# EAGLE design new inverter (EAGLE 9.3.2)
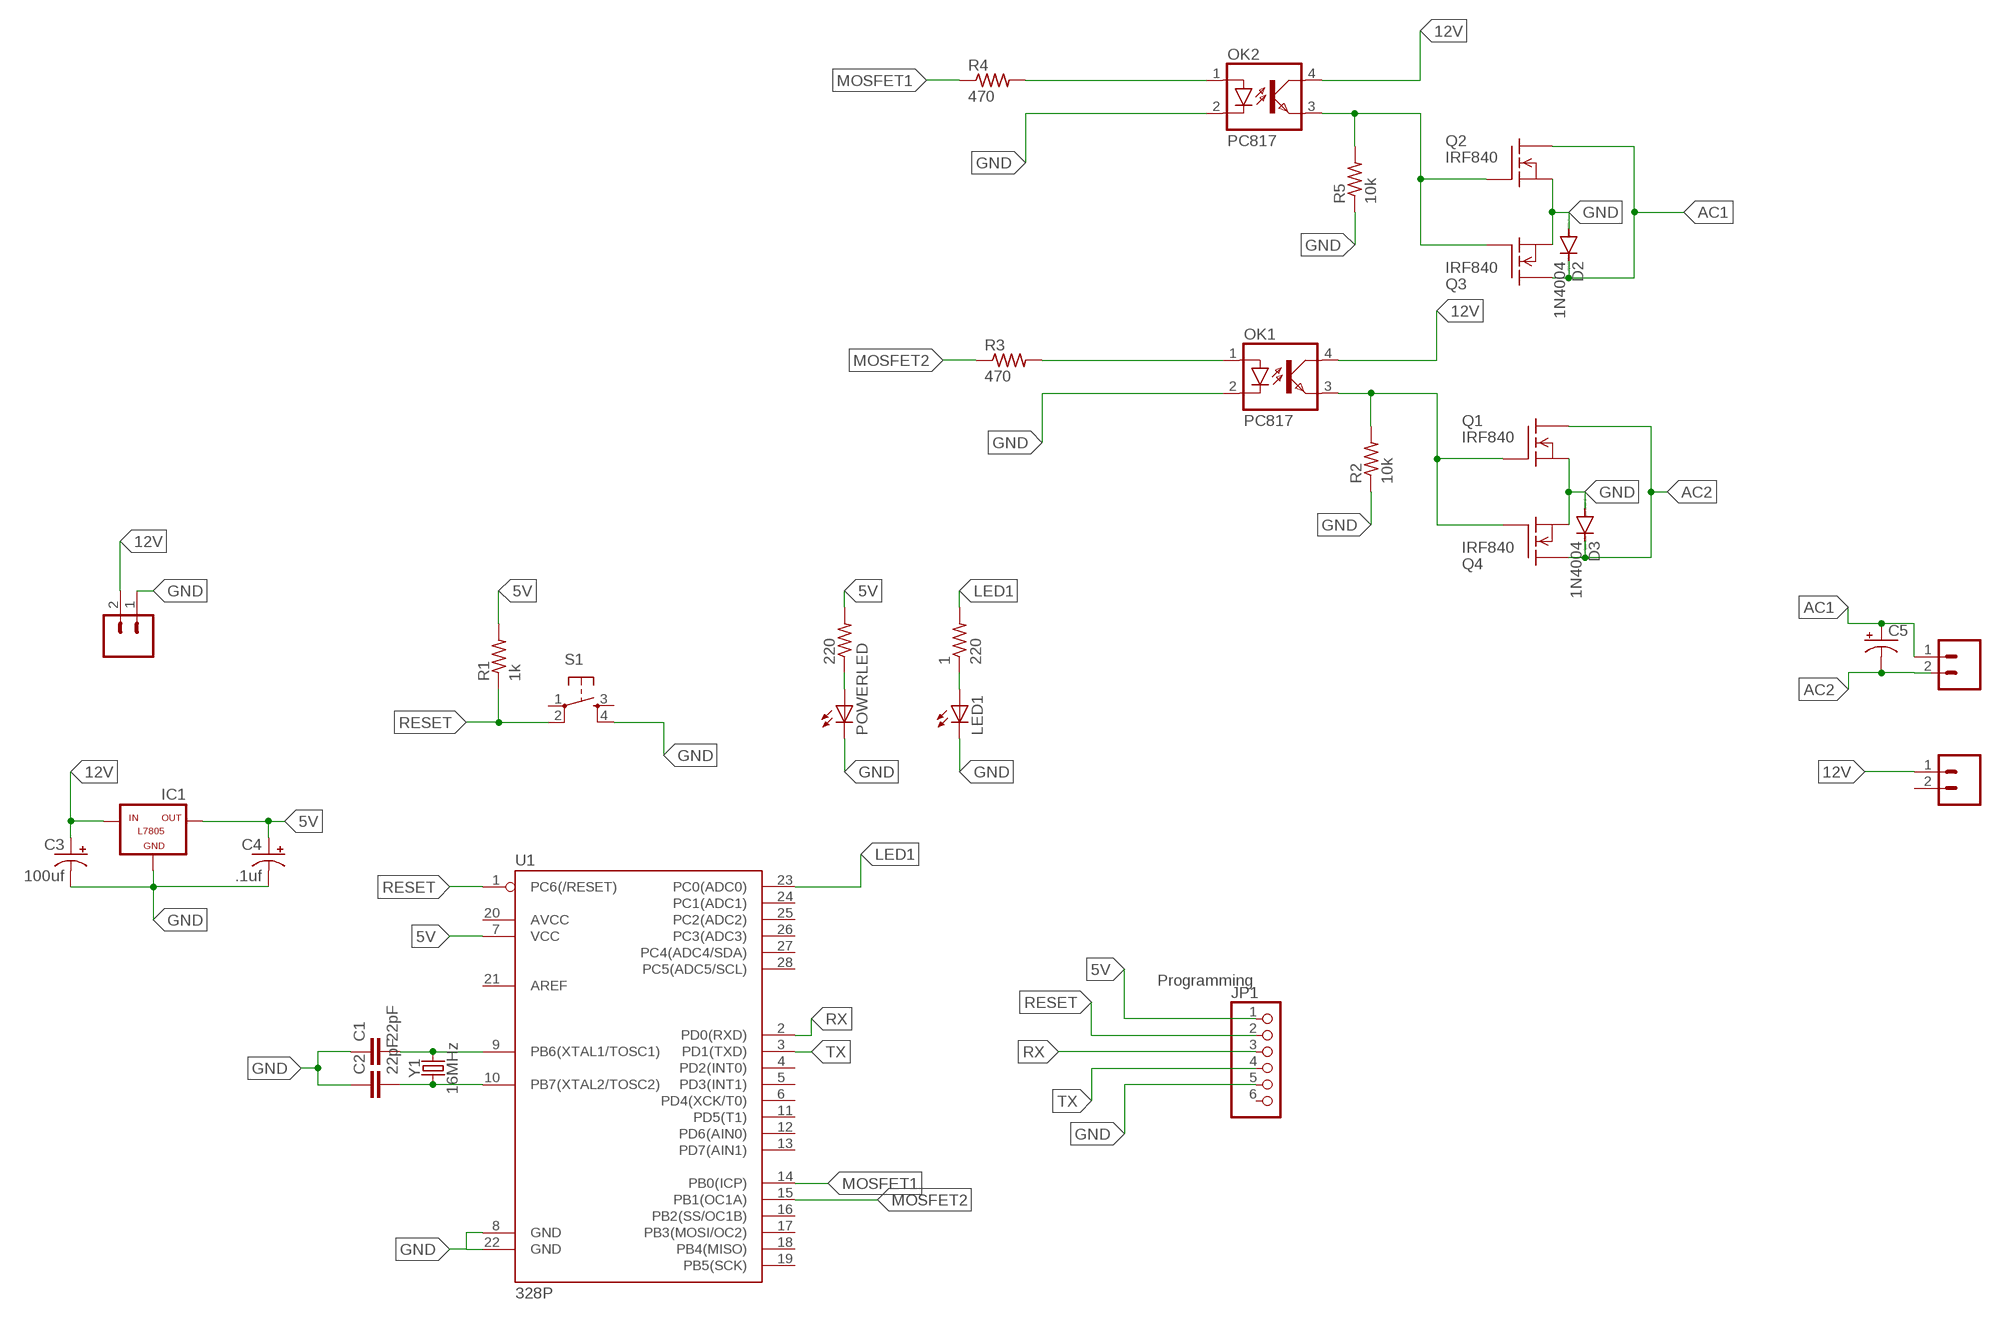
[diagram p0: schematic, sheet 1]

## Parts
1  220  R-US_0204/5  [0204/5]
220  R-US_0204/5  [0204/5]
C1  22pF  22PF-PTH-2.54MM-200V-5%  [CAP-PTH-2.54]
C2  22pF  22PF-PTH-2.54MM-200V-5%  [CAP-PTH-2.54]
C3  100uf  CPOL-USE5-5  [E5-5]
C4  .1uf  CPOL-USE5-5  [E5-5]
C5  CPOL-USE5-13  [E5-13]
D2  1N4004  [DO41-10]
D3  1N4004  [DO41-10]
IC1  L7805  [78XXL]
J1  CONN_025MM  [SCREWTERMINAL-5MM-2]
J2  CONN_025MM  [SCREWTERMINAL-5MM-2]
J3  CONN_025MM  [SCREWTERMINAL-5MM-2]
JP1  PINHD-1X6  [1X06]
LED1  LED5MM  [LED5MM]
OK1  PC817  [DIL04]
OK2  PC817  [DIL04]
POWERLED  LED5MM  [LED5MM]
Q1  IRF840  [TO220]
Q2  IRF840  [TO220]
Q3  IRF840  [TO220]
Q4  IRF840  [TO220]
R1  1k  R-US_0204/5  [0204/5]
R2  10k  R-US_0204/5  [0204/5]
R3  470  R-US_0204/5  [0204/5]
R4  470  R-US_0204/5  [0204/5]
R5  10k  R-US_0204/5  [0204/5]
S1  TAC_SWITCHPTH  [TACTILE-PTH]
U1  328P  ATMEGA328P_PDIP  [DIP28]
Y1  16MHz  CRYSTAL-16MHZPTH-HC49US  [HC49US]

## Nets
5V: 220.2 C4.+ IC1.OUT JP1.1 R1.2 U1.7(VCC)
12V: C3.+ IC1.IN J1.2 J2.1 OK1.4(COL) OK2.4(COL)
AC1: C5.+ D2.C J3.1 Q2.2(D) Q3.2(D)
AC2: C5.- D3.C J3.2 Q1.2(D) Q4.2(D)
GND: C1.1 C2.1 C3.- C4.- D2.A D3.A IC1.GND J1.1 JP1.5 LED1.K(C) OK1.2(C) OK2.2(C) POWERLED.K(C) Q1.3(S) Q2.3(S) Q3.3(S) Q4.3(S) R2.1 R5.1 S1.4 U1.8(GND) U1.22(GND)
LED1: 1.2 U1.23(PC0(ADC0))
MOSFET1: R4.1 U1.14(PB0(ICP))
MOSFET2: R3.1 U1.15(PB1(OC1A))
N$1: 220.1 POWERLED.A
N$2: C1.2 U1.9(PB6(XTAL1/TOSC1)) Y1.2
N$3: C2.2 U1.10(PB7(XTAL2/TOSC2)) Y1.1
N$4: OK1.1(A) R3.2
N$5: OK1.3(EMIT) Q1.1(G) Q4.1(G) R2.2
N$6: OK2.3(EMIT) Q2.1(G) Q3.1(G) R5.2
N$7: OK2.1(A) R4.2
N$8: 1.1 LED1.A
RESET: JP1.2 R1.1 S1.2 U1.1(PC6(/RESET))
RX: JP1.3 U1.2(PD0(RXD))
TX: JP1.4 U1.3(PD1(TXD))
Unconnected: J2.2 JP1.6 S1.1 S1.3 U1.4(PD2(INT0)) U1.5(PD3(INT1)) U1.6(PD4(XCK/T0)) U1.11(PD5(T1)) U1.12(PD6(AIN0)) U1.13(PD7(AIN1)) U1.16(PB2(SS/OC1B)) U1.17(PB3(MOSI/OC2)) U1.18(PB4(MISO)) U1.19(PB5(SCK)) U1.20(AVCC) U1.21(AREF) U1.24(PC1(ADC1)) U1.25(PC2(ADC2)) U1.26(PC3(ADC3)) U1.27(PC4(ADC4/SDA)) U1.28(PC5(ADC5/SCL))

## Notes on the sheet
- Programming

## Library data of the parts
1 220 R1-R5 = adafruit:R-US_: RESISTOR, American symbol
C1 C2 = SparkFun-Capacitors:22PF: 22pF ceramic capacitors A capacitor is a passive two-terminal electrical component used to store electrical energy temporarily in an electric field.; PROD_ID: CAP-09128
C3-C5 = adafruit:CPOL-US: POLARIZED CAPACITOR, American symbol
D2 D3 = diode:1N4004: DIODE general purpose rectifier, 1 A
IC1 = tango:L7805: VOLTAGE REGULATOR
J1-J3 = SparkFun-Connectors:CONN_02: Multi connection point. Often used as Generic Header-pin footprint for 0.1 inch spaced/style header connections On any of the 0.1 inch spaced packages, you can populate with these: Break Away Headers - Straight <https://www.sparkfun.com/products/116> (PRT-00116) Break Away Male Headers - Right Angle <https://www.sparkfun.com/products/553> (PRT-00553) Female Headers <https://www.sparkfun.com/products/115> (PRT-00115) Break Away Headers - Machine Pin <https://www.sparkfun.com/products/117> (PRT-00117) Break Away Female Headers - Swiss Machine Pin <https://www.sparkfun.com/products/743> (PRT-00743) For SCREWTERMINALS and SPRING TERMINALS visit here: Screw Terimnals on SparkFun.com <https://www.sparkfun.com/search/results?term=Screw+Terminals> (5mm/3.5mm/2.54mm spacing) This device is also useful as a general connection point to wire up your design to another part of your project. Our various solder wires solder well into these plated through hole pads. Hook-Up Wire - Assortment (Stranded, 22 AWG) <https://www.sparkfun.com/products/11375> (PRT-11375) Hook-Up Wire - Assortment (Solid Core, 22 AWG) <https://www.sparkfun.com/products/11367> (PRT-11367) View the entire wire category on our website here <https://www.sparkfun.com/categories/141> Special notes: Molex polarized connector foot print use with: PRT-08233 with associated crimp pins and housings. 2.54_SCREWTERM for use with PRT-10571. 3.5mm Screw Terminal footprints for PRT-08084 5mm Screw Terminal footprints for use with PRT-08432; SF_SKU: PRT-08432
JP1 = adafruit:PINHD-1X6: PIN HEADER
LED1 POWERLED = adafruit:LED: LED OSRAM: - CHIPLED LG R971, LG N971, LY N971, LG Q971, LY Q971, LO R971, LY R971 LH N974, LH R974 LS Q976, LO Q976, LY Q976 LO Q996 - Hyper CHIPLED LW Q18S LB Q993, LB Q99A, LB R99A - SideLED LS A670, LO A670, LY A670, LG A670, LP A670 LB A673, LV A673, LT A673, LW A673 LH A674 LY A675 LS A676, LA A676, LO A676, LY A676, LW A676 LS A679, LY A679, LG A679 - Hyper Micro SIDELED® LS Y876, LA Y876, LO Y876, LY Y876 LT Y87S - SmartLED LW L88C, LW L88S LB L89C, LB L89S, LG L890 LS L89K, LO L89K, LY L89K LS L896, LA L896, LO L896, LY L896 - TOPLED LS T670, LO T670, LY T670, LG T670, LP T670 LSG T670, LSP T670, LSY T670, LOP T670, LYG T670 LG T671, LOG T671, LSG T671 LB T673, LV T673, LT T673, LW T673 LH T674 LS T676, LA T676, LO T676, LY T676, LB T676, LH T676, LSB T676, LW T676 LB T67C, LV T67C, LT T67C, LS T67K, LO T67K, LY T67K, LW E67C LS E67B, LA E67B, LO E67B, LY E67B, LB E67C, LV E67C, LT E67C LW T67C LS T679, LY T679, LG T679 LS T770, LO T770, LY T770, LG T770, LP T770 LB T773, LV T773, LT T773, LW T773 LH T774 LS E675, LA E675, LY E675, LS T675 LS T776, LA T776, LO T776, LY T776, LB T776 LHGB T686 LT T68C, LB T68C - Hyper Mini TOPLED® LB M676 - Mini TOPLED Santana® LG M470 LS M47K, LO M47K, LY M47K Source: http://www.osram.convergy.de/
OK1 OK2 = optocoupler:PC817: SHARP OPTO COUPLER; MPN: PC817X4J000F; OC_FARNELL: 9707727; OC_NEWARK: 97K7059
Q1-Q4 = transistor-fet:IRF840: N-Channel Enhancement MOSFET (HEXFET); 500V; 8A; 0,85Ohm
S1 = SparkFun-Retired:TAC_SWITCH: Momentary Switch Button commonly used for reset or general input. Spark Fun Electronics SKU : COM-00097 SMT- SWCH-08247
U1 = SparkFun-IC-Microcontroller:ATMEGA328P_PDIP: Atmel 328P Through hole ATMEGA328P uC used in the Arduino 32kb flash, 1k EEPROM, 2k SRAM Datasheet <http://www.sparkfun.com/datasheets/Components/SMD/ATMega328.pdf> SparkFun Products Storefront component: AVR 28 Pin 20MHz 32K 6A/D - ATMega328P <https://www.sparkfun.com/products/9061> (COM-09061) SparkFun Simon Says - Through-Hole Soldering Kit <https://www.sparkfun.com/products/10547> (KIT-10547) SparkFun Learn to Solder - Simon Says <https://www.sparkfun.com/products/13708> (KIT-13708) SparkFun BigTime Watch Kit <https://www.sparkfun.com/products/11734> (KIT-11734) SparkFun ClockIt <https://www.sparkfun.com/products/10930> (KIT-10930) SparkFun Serial Enabled LCD Kit <https://www.sparkfun.com/products/10097> (LCD-10097) SparkFun Simon Tilts - Through Hole Soldering Kit <https://www.sparkfun.com/products/12634> (KIT-12634) SparkFun Frequency Counter Kit <https://www.sparkfun.com/products/10140> (KIT-10140) FabFM Radio Kit <https://www.sparkfun.com/products/11043> (KIT-11043) SparkFun Binary Blaster Kit <https://www.sparkfun.com/products/12037> (KIT-12037) SparkFun Metro-Gnome <https://www.sparkfun.com/products/9236> (KIT-09236) ATmega328 with Arduino Optiboot (Uno) <https://www.sparkfun.com/products/10524> (DEV-10524); PROD_ID: IC-09136
Y1 = SparkFun-Clocks:CRYSTAL-16MHZ: 16MHz Crystal Digikey Example <http://www.digikey.com/product-search/en?keywords=535-9122-1-ND> Frequency: 16MHz Frequency Stability: ±50ppm Frequency Tolerance: ±20ppm Load Capacitance: 18pF SparkFun Products: Pro Micro -5V/16MHz <https://www.sparkfun.com/products/12640> SparkFun Serial Enabled LCD Kit <https://www.sparkfun.com/products/10097>; PROD_ID: XTAL-08181; SF_ID: COM-00536

## Board
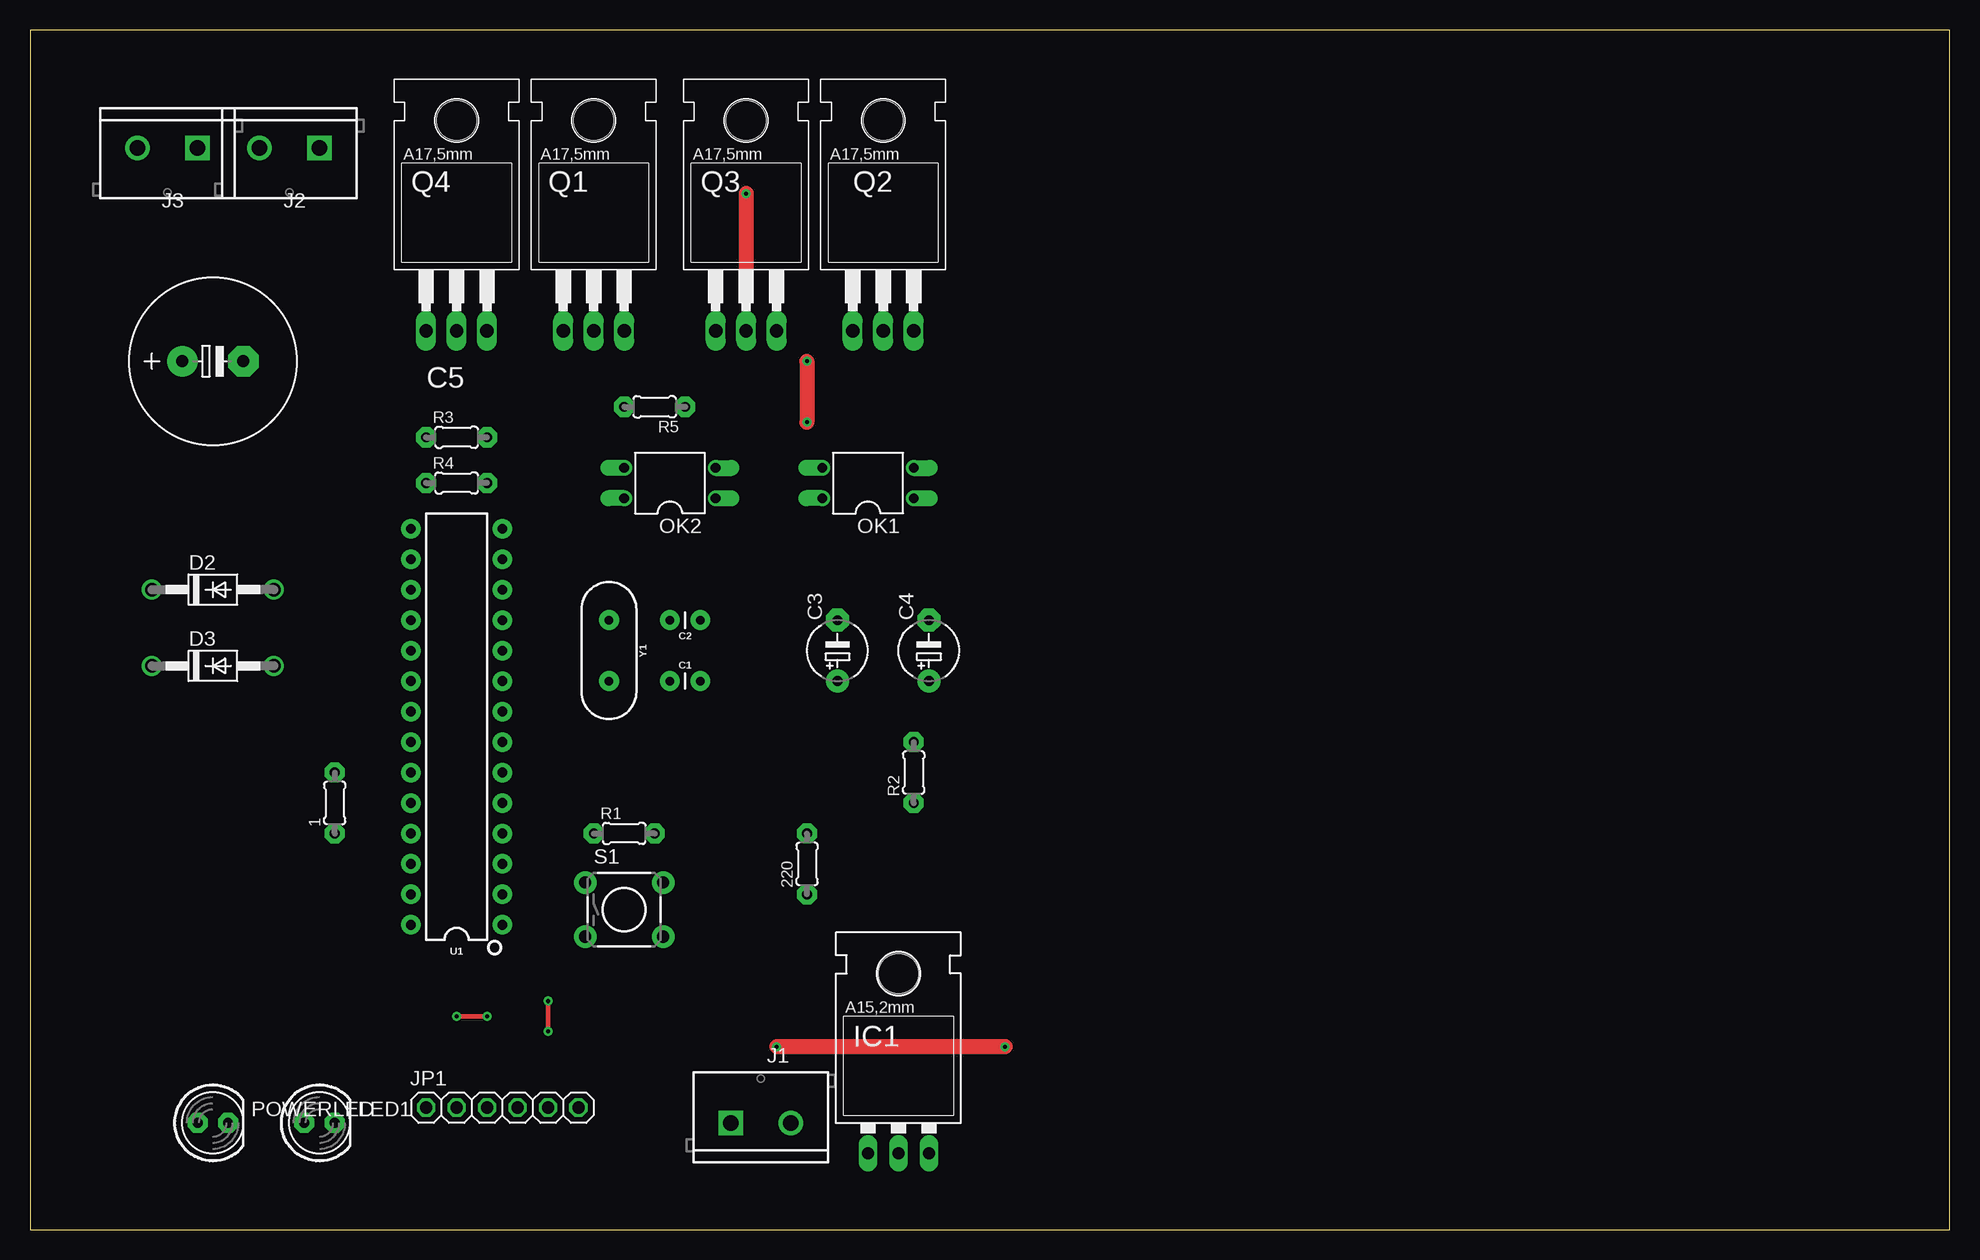
[diagram p1: board, top side]
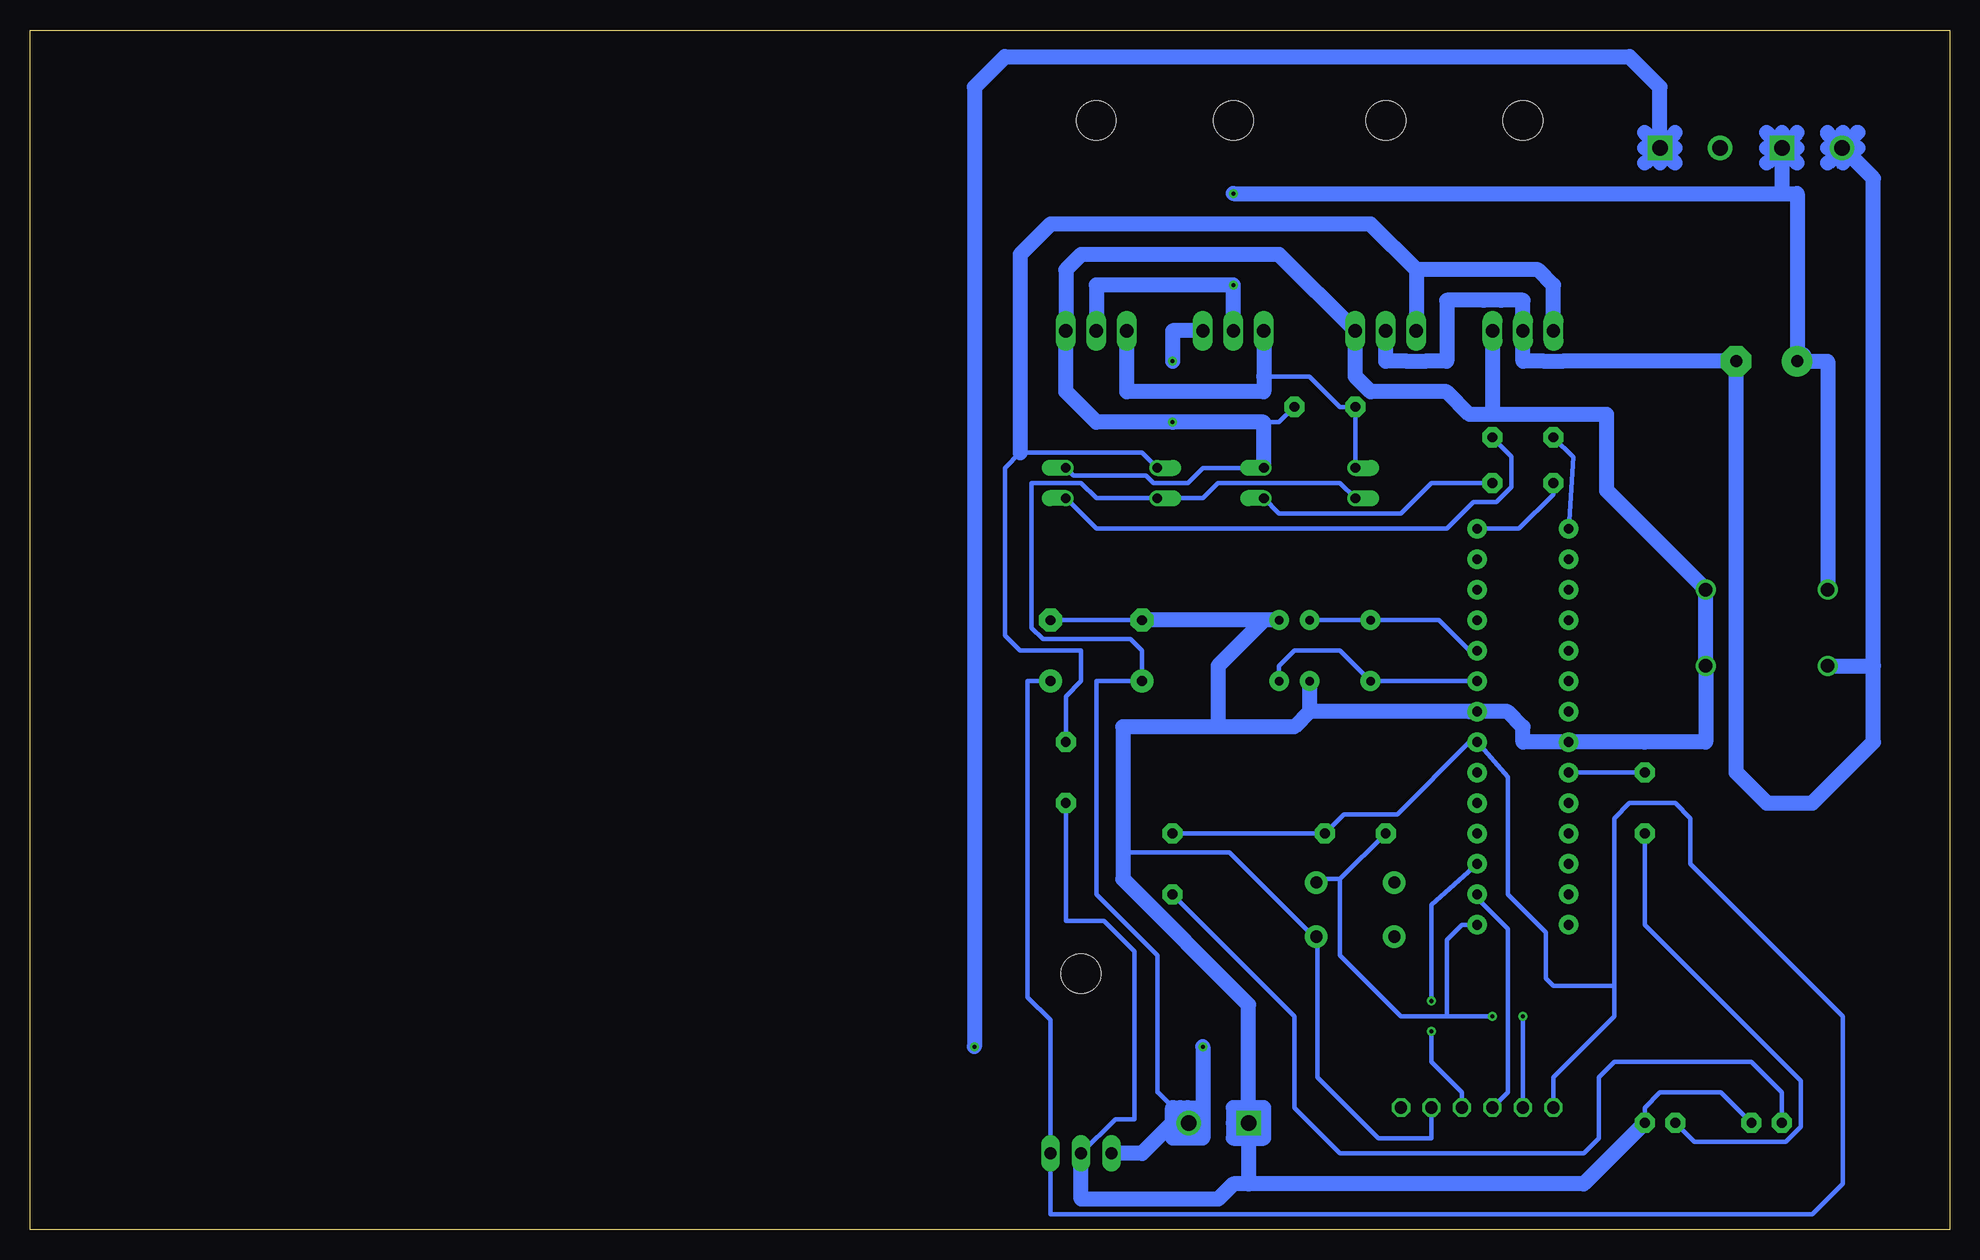
[diagram p2: board, bottom side, seen from below]

Size 160 x 100 mm. Coordinates in mm from the lower left corner, seen from the top.
Outline: 0,0 160,0 160,100 0,100 0,0
Copper layers (1*16): Top 0.035mm / dielectric 1.5mm / Bottom 0.035mm
Design rules "default *": minimum track width 15mil, minimum drill 0.35mm, track to track 10mil, track to pad 10mil, pad to pad 6mil, via to via 6mil, smd to smd 6mil, copper to edge 40mil, drill to drill 6mil, minimum pad ring 10mil, minimum via ring 8mil, stop-mask expansion 4mil, vias tented up to drill 0mil, thermal gap 10mil

### Footprints (pad centres in the part's own frame; a part is rotated, then mirrored left to right if it is on the bottom)
0204/5 = drill 0.813 pad 1.676 octagon: 1 -2.54,0; 2 2.54,0
CAP-PTH-2.54 = drill 0.7 pad 1.651: 1 -1.27,0; 2 1.27,0
E5-5 = drill 0.813 pad 1.905: + -2.54,0 | drill 0.813 pad 1.905 octagon: - 2.54,0
E5-13 = drill 1.016 pad 2.54: + -2.54,0 | drill 1.016 pad 2.54 octagon: - 2.54,0
DO41-10 = drill 1.118: A 5.08,0; C -5.08,0
78XXL = drill 1.016 long: GND 0,-3.81; IN -2.54,-3.81; OUT 2.54,-3.81 | hole 3.302: 0,11.176
SCREWTERMINAL-5MM-2 = drill 1.3 pad 2.032 square: 1 0,0 | drill 1.3 pad 2.032: 2 5,0
1X06 = drill 1.016 octagon: 1 -6.35,0; 2 -3.81,0; 3 -1.27,0; 4 1.27,0; 5 3.81,0; 6 6.35,0
LED5MM = drill 0.813 pad 1.676 octagon: A -1.27,0; K 1.27,0
DIL04 = drill 0.813 offset: 1 -1.27,-3.81; 2 1.27,-3.81; 3 1.27,3.81; 4 -1.27,3.81
TO220 = drill 1.118 long: 1 -2.54,-6.35; 2 0,-6.35; 3 2.54,-6.35 | hole 3.302: 0,11.176
TACTILE-PTH = drill 1.016 pad 1.88: 1 -3.251,2.261; 2 3.251,2.261; 3 -3.251,-2.261; 4 3.251,-2.261
DIP28 = drill 0.813 pad 1.626: 1 -16.51,-3.81; 2 -13.97,-3.81; 3 -11.43,-3.81; 4 -8.89,-3.81; 5 -6.35,-3.81; 6 -3.81,-3.81; 7 -1.27,-3.81; 8 1.27,-3.81; 9 3.81,-3.81; 10 6.35,-3.81; 11 8.89,-3.81; 12 11.43,-3.81; 13 13.97,-3.81; 14 16.51,-3.81; 15 16.51,3.81; 16 13.97,3.81; 17 11.43,3.81; 18 8.89,3.81; 19 6.35,3.81; 20 3.81,3.81; 21 1.27,3.81; 22 -1.27,3.81; 23 -3.81,3.81; 24 -6.35,3.81; 25 -8.89,3.81; 26 -11.43,3.81; 27 -13.97,3.81; 28 -16.51,3.81
HC49US = drill 0.7 pad 1.651: 1 -2.54,0; 2 2.54,0

### Placement (x,y rotation side)
1  25.4,35.56 90 top
220  64.77,30.48 90 top
C1  54.61,45.72 0 top
C2  54.61,50.8 180 top
C3  67.31,48.26 90 top
C4  74.93,48.26 90 top
C5  15.24,72.39 0 top
D2  15.24,53.34 0 top
D3  15.24,46.99 0 top
IC1  72.39,10.16 0 top
J1  58.42,8.89 0 top
J2  24.13,90.17 180 top
J3  13.97,90.17 180 top
JP1  39.37,10.16 0 top
LED1  24.13,8.89 0 top
OK1  69.85,62.23 90 top
OK2  53.34,62.23 90 top
POWERLED  15.24,8.89 0 top
Q1  46.99,81.28 0 top
Q2  71.12,81.28 0 top
Q3  59.69,81.28 0 top
Q4  35.56,81.28 0 top
R1  49.53,33.02 0 top
R2  73.66,38.1 90 top
R3  35.56,66.04 0 top
R4  35.56,62.23 0 top
R5  52.07,68.58 180 top
S1  49.53,26.67 0 top
U1  35.56,41.91 90 top
Y1  48.26,48.26 270 top

### Tracks (layer width: path | path; a pad name or v marks a point on that pad's centre or on a via)
5V
  Bottom 0.381: C4.+ 76.83,45.72 76.83,19.37 74.93,17.46 IC1.OUT 74.93,1.27 11.43,1.27 8.89,3.81 8.89,17.78 21.59,30.48 21.59,34.29 22.86,35.56 26.67,35.56 27.94,34.29 27.94,20.32 | 220.2 R1.2 50.48,34.61 46.04,34.61 40.01,40.64 U1.7 36.83,37.72 36.83,27.94 33.66,24.77 33.66,20.96 33.02,20.32 27.94,20.32 | 27.94,20.32 27.94,17.78 33.02,12.7 JP1.1
12V  (via drill 0.35)
  Top 1.27: v81.28,15.24 v62.23,15.24
  Bottom 0.381: OK2.4 50.8,62.23 60.96,62.23 62.23,60.96 OK1.4 71.12,60.96 72.39,62.23 76.52,62.23 76.52,50.16 75.56,49.21 68.26,49.21 67.31,48.26 C3.+ 71.12,45.72 71.12,27.94 66.04,22.86 66.04,11.43 65.96,11.43 64.69,10.16 | 64.14,10.16 64.14,8.89
  Bottom 1.27: IC1.IN 67.31,6.35 64.77,8.89 64.14,8.89 63.5,8.89 | v81.28,15.24 81.28,95.25 78.74,97.79 26.67,97.79 24.13,95.25 J2.1 | v62.23,15.24 62.23,10.16 | 62.23,10.16 62.23,8.89 | 62.23,8.89 J1.2 | J2.1 22.86,90.17 | J2.1 24.13,88.9 | J2.1 25.4,90.17 | J2.1 25.4,88.9 | J2.1 22.86,88.9 | J2.1 22.86,91.44 | J2.1 25.4,91.44 | J1.2 63.5,8.97 | 63.5,8.97 63.5,10.16 | 63.5,8.97 63.5,8.89 | 63.5,8.89 63.5,7.62 63.42,7.7 J1.2 | 62.23,7.7 62.23,7.62 64.69,7.62 | 62.23,7.7 J1.2 | J1.2 64.14,9.61 64.14,10.16 | J1.2 64.69,7.62 | 64.69,7.62 64.77,7.62 63.5,8.89 | J1.2 64.69,10.16 | 64.69,10.16 64.77,10.16 | 64.77,10.16 63.5,8.89 | 62.23,8.89 62.23,7.7 | 64.69,7.62 64.77,7.7 64.77,10.16 | 64.69,10.16 62.23,10.16
AC1  (via drill 0.35)
  Top 1.27: v59.69,86.36 v59.69,78.74
  Bottom 1.27: 12.17,72.92 C5.+ | C5.+ 10.16,72.39 D2.C | Q2.2 71.12,78.74 v59.69,78.74 Q3.2 | C5.+ 12.7,86.36 13.97,86.36 | v59.69,86.36 13.97,86.36 | J3.1 13.97,86.36 | 12.7,90.17 J3.1 | J3.1 13.97,91.44 | J3.1 15.24,90.17 | J3.1 12.7,91.44 | J3.1 15.24,91.44 | J3.1 12.7,88.9 | J3.1 15.24,88.9
AC2
  Bottom 0.381: Q4.2 35.56,75.56
  Bottom 1.27: 6.35,46.99 6.35,40.64 11.43,35.56 15.24,35.56 17.78,38.1 C5.- 32.28,72.39 32.3,72.36 33.73,72.36 33.76,72.39 35.56,72.39 Q4.2 35.56,77.47 37.36,77.47 37.38,77.49 38.81,77.49 38.84,77.47 41.91,77.47 41.91,72.39 43.71,72.39 43.73,72.36 45.16,72.36 45.19,72.39 46.99,72.39 Q1.2 | D3.C 6.35,46.99 | 6.35,46.99 6.35,87.63 8.89,90.17 J3.2 | J3.2 7.7,91.44 7.62,91.44 | J3.2 8.97,90.09 10.16,88.9 | J3.2 10.16,91.36 10.16,91.44 | J3.2 8.97,91.36 8.89,91.44 | J3.2 10.16,90.17 | J3.2 8.97,88.98 8.89,88.9 | J3.2 7.62,90.17
GND  (via drill 0.35)
  Top 1.27: v64.77,72.39 v64.77,67.31
  Bottom 0.381: R2.1 73.66,25.72 70.48,25.72 67.94,23.18 67.94,9.21 69.53,9.21 IC1.GND | OK1.2 73.03,62.87 66.99,62.87 66.36,62.23 63.5,62.23 62.23,63.5 OK2.2 | C3.- C4.- | 40.01,43.18 50.8,43.18 | 31.43,40.64 U1.22 25.4,40.64 | 68.9,31.43 60.01,31.43 53.02,24.45 S1.4 52.7,24.13 52.7,12.7 47.62,7.62 43.18,7.62 JP1.5 | 68.9,31.43 68.9,29.21 | 68.9,41.91 68.9,31.43 | POWERLED.K 19.05,11.43 24.13,11.43 25.4,10.16 LED1.K | 38.1,68.58 38.1,67.94 33.97,67.94 | 59.69,67.31 v64.77,67.31 | R5.1 55.88,67.31 57.15,67.31
  Bottom 1.27: 60.96,41.91 68.9,41.91 68.9,29.21 58.42,18.73 J1.1 | 60.96,41.91 60.96,46.99 57.15,50.8 C2.1 C3.- | 53.34,43.18 54.61,41.91 60.96,41.91 | 53.34,43.18 40.01,43.18 U1.8 36.83,43.18 35.56,41.91 35.56,40.64 U1.22 31.59,40.8 31.43,40.64 25.4,40.64 20.32,40.64 D3.A D2.A 28.57,61.6 28.57,67.94 33.97,67.94 40.01,67.94 41.91,69.85 48.26,69.85 49.53,71.12 Q1.3 55.88,81.28 72.39,81.28 73.66,80.01 Q2.3 73.66,69.85 71.12,67.31 v64.77,67.31 57.15,67.31 OK2.2 | C1.1 53.34,43.18 | Q4.3 38.1,68.58 | Q3.3 64.77,74.93 v64.77,72.39 | IC1.GND 72.39,2.54 60.96,2.54 59.69,3.81 58.42,3.81 | J1.1 58.42,3.81 | 58.42,3.81 30.48,3.81 LED1.K | 57.15,8.89 J1.1 | 59.69,8.89 J1.1 | J1.1 57.15,10.16 | J1.1 59.69,7.62 | 59.69,7.62 57.15,7.62 57.15,10.16 | 57.15,10.16 59.69,10.16 59.69,7.62
LED1
  Bottom 0.381: U1.23 1.2
MOSFET1
  Bottom 0.381: U1.14 35.88,58.42 33.02,61.28 R4.1
MOSFET2
  Bottom 0.381: R3.1 31.37,64.39 U1.15
N$1
  Bottom 0.381: 220.1 54.61,17.78 54.61,10.16 50.8,6.35 30.48,6.35 29.21,7.62 29.21,12.7 27.94,13.97 16.51,13.97 13.97,11.43 POWERLED.A
N$2
  Bottom 0.381: U1.9 Y1.2 50.8,48.26 54.61,48.26 55.88,46.99 C1.2
N$3
  Bottom 0.381: C2.2 Y1.1 42.55,50.8 40.01,48.26 U1.10
N$4
  Bottom 0.381: OK1.1 71.12,58.42 41.91,58.42 39.69,60.64 37.78,60.64 36.51,61.91 36.51,64.45 R3.2
N$5
  Bottom 0.381: OK1.3 67.31,64.77 77.47,64.77 78.74,63.5 78.74,49.53 77.47,48.26 72.39,48.26 72.39,45.72 73.66,44.45 R2.2
  Bottom 1.27: Q4.1 33.02,78.74 34.29,80.01 44.45,80.01 | 44.45,80.01 Q1.1 | 77.47,64.77 77.47,81.28 74.93,83.82 48.26,83.82 44.45,80.01
N$6
  Bottom 0.381: OK2.3 R5.2 50.8,68.58 53.34,71.12 57.15,71.12
  Bottom 1.27: Q3.1 57.15,71.12 57.15,69.85 68.58,69.85 Q2.1
N$7
  Bottom 0.381: OK2.1 55.88,59.69 45.72,59.69 43.18,62.23 R4.2
N$8
  Bottom 0.381: LED1.A 21.27,7.3 13.65,7.3 12.38,8.57 12.38,12.38 25.4,25.4 1.1
RESET  (via drill 0.35)
  Top 0.381: v38.1,17.78 v35.56,17.78
  Bottom 0.381: 50.8,29.21 R1.1 | 50.8,29.21 52.7,29.21 S1.2 | 40.01,25.4 U1.1 40.64,25.4 41.91,24.13 41.91,17.78 | v35.56,17.78 JP1.2 | 41.91,17.78 v38.1,17.78 | 41.91,17.78 45.72,17.78 50.8,22.86 50.8,29.21
RX
  Bottom 0.381: U1.2 39.69,27.94 36.83,25.08 36.83,11.43 JP1.3
TX  (via drill 0.35)
  Top 0.381: v43.18,19.05 v43.18,16.51
  Bottom 0.381: U1.3 43.18,27.05 v43.18,19.05 | v43.18,16.51 43.18,13.97 40.64,11.43 JP1.4